# EAGLE design BusPirate-v4c (EAGLE 5.07)
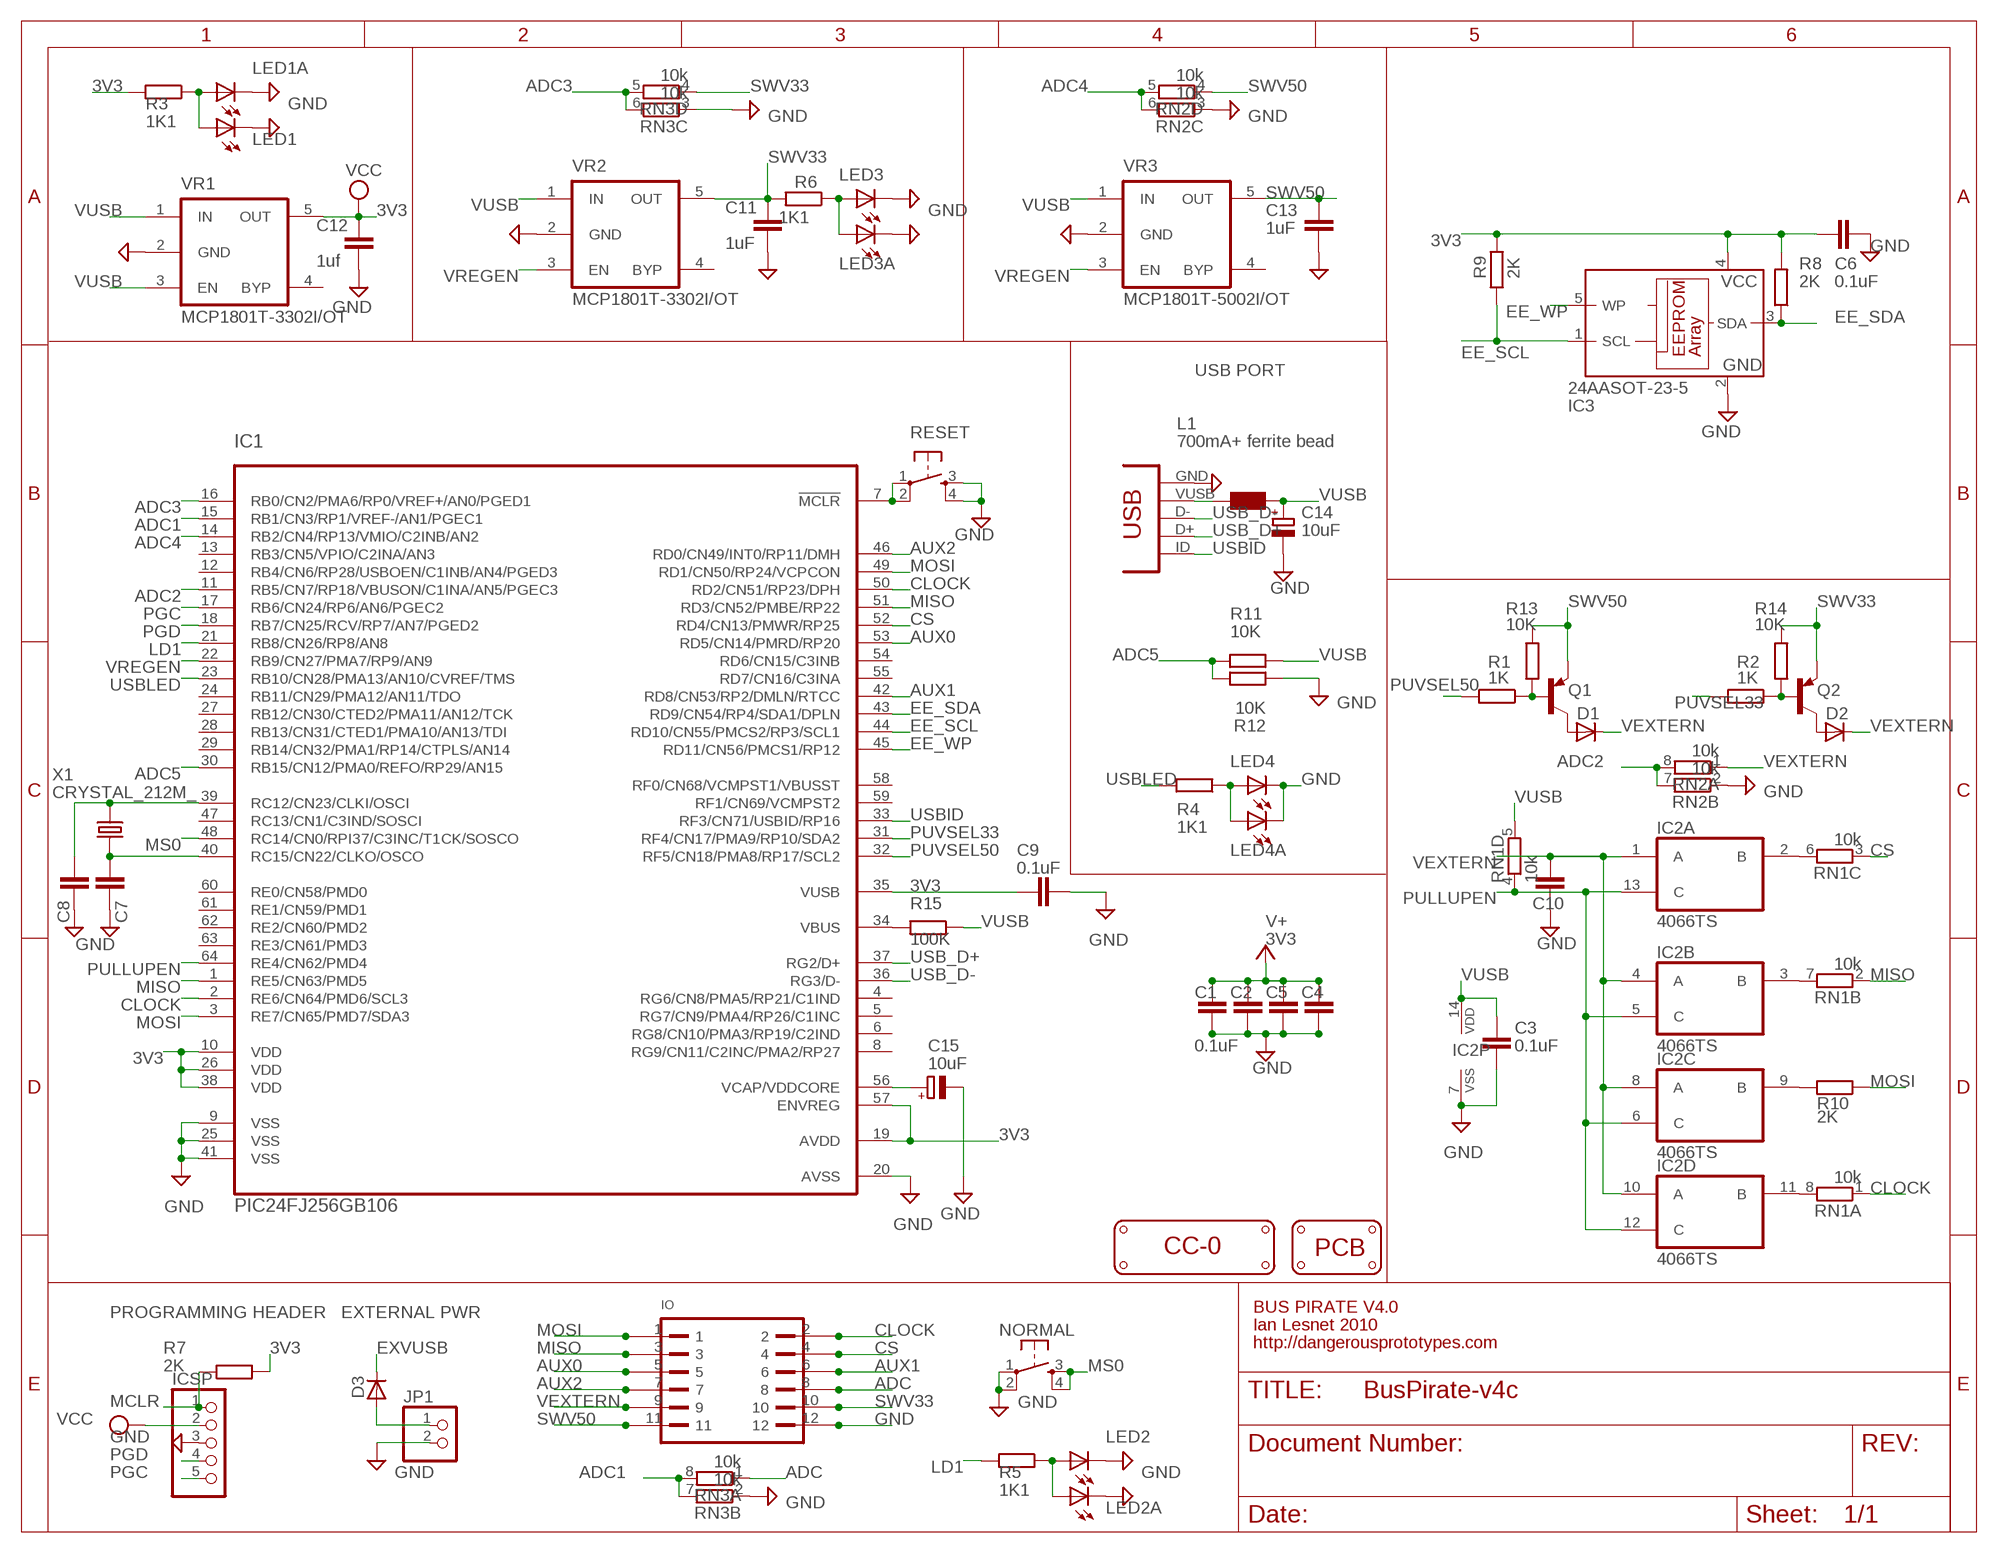
[diagram p0: schematic, sheet 1]

## Parts
C1  0.1uF  C-EUC0603  [C0603]
C2  0.1uF  C-EUC0603  [C0603]
C3  0.1uF  C-EUC0603  [C0603]
C4  0.1uF  C-EUC0603  [C0603]
C5  0.1uF  C-EUC0603  [C0603]
C6  0.1uF  C-EUC0603  [C0603]
C7  0.1uF  C-EUC0603  [C0603]
C8  0.1uF  C-EUC0603  [C0603]
C9  0.1uF  C-EUC0603  [C0603]
C10  0.1uF  C-EUC0603  [C0603]
C11  1uF  C-EUC0603  [C0603]
C12  1uf  C-EUC0603  [C0603]
C13  1uF  C-EUC0603  [C0603]
C14  10uF  CPOL-EUSMCA  [SMC_A]
C15  10uF  CPOL-EUSMCA  [SMC_A]
D1  MBR0520LT  [SOD123]
D2  MBR0520LT  [SOD123]
D3  MBR0520LT  [SOD123]
IC1  PIC24FJ256GB106  [TQFP64-10X10]
IC2  4066TS  [40XX_TSSOP14]
IC3  24AASOT-23-5  24AA  [SOT-23-5]
ICSP  PINHD-1X5  [1X05]
IO  PINSHRD-PTH-2X06  [PINSHRD_PTH_2X06]
JP1  PINHD-1X02_2.54-S  [1X02-S]
L1  700mA+ ferrite bead  WE-KIL_0805  [WE-KI_0805_B]
LED1  LEDCHIP-LED0805  [CHIP-LED0805]
LED1A  LEDCHIP-LED0805  [CHIP-LED0805]
LED2  LEDCHIP-LED0805  [CHIP-LED0805]
LED2A  LEDCHIP-LED0805  [CHIP-LED0805]
LED3  LEDCHIP-LED0805  [CHIP-LED0805]
LED3A  LEDCHIP-LED0805  [CHIP-LED0805]
LED4  LEDCHIP-LED0805  [CHIP-LED0805]
LED4A  LEDCHIP-LED0805  [CHIP-LED0805]
LOGO1  LOGO_CC-0  [LOGO_CC-0]
NORMAL  SMD_TACT_SMALL  [TACT_SWITCH_SMALL]
PCB1  PCB_DP_RECTANGLE-37X60  [DP6037_V1]
Q1  MMBTA56-SOT23  [SOT23]
Q2  MMBTA56-SOT23  [SOT23]
R1  1K  RESISTOR-0603  [R603]
R2  1K  R-EU_R0603  [R0603]
R3  1K1  RESISTOR-0603  [R603]
R4  1K1  RESISTOR-0603  [R603]
R5  1K1  RESISTOR-0603  [R603]
R6  1K1  RESISTOR-0603  [R603]
R7  2K  R-EU_R0603  [R0603]
R8  2K  R-EU_R0603  [R0603]
R9  2K  R-EU_R0603  [R0603]
R10  2K  R-EU_R0603  [R0603]
R11  10K  R-EU_R0603  [R0603]
R12  10K  R-EU_R0603  [R0603]
R13  10K  RESISTOR-0603  [R603]
R14  10K  R-EU_R0603  [R0603]
R15  100K  R-EU_R0603  [R0603]
RESET  SMD_TACT_SMALL  [TACT_SWITCH_SMALL]
RN1  10k  RNETWORK  [RN8P-4R-CRA06S]
RN2  10k  RNETWORK  [RN8P-4R-CRA06S]
RN3  10k  RNETWORK  [RN8P-4R-CRA06S]
USB  USB mini-b  CON-USB-MINI-BUSB1  [CONN_USB_MINI-B]
VR1  MCP1801T-3302I/OT  MIC5205  [SOT-23-5]
VR2  MCP1801T-3302I/OT  MIC5205  [SOT-23-5]
VR3  MCP1801T-5002I/OT  MIC5205  [SOT-23-5]
X1  CRYSTAL_212M_  [4X6]

## Nets
3V3: C1.1 C2.1 C4.1 C5.1 C6.1 C9.1 C12.1 IC1.10(VDD) IC1.19(AVDD) IC1.26(VDD) IC1.35(VUSB) IC1.38(VDD) IC1.57(ENVREG) IC3.4(VCC) ICSP.2 R3.2 R7.2 R8.2 R9.2 VR1.5(OUT) ; supply symbol labelled VCC, V+
ADC: IO.8 RN3.1
ADC1: IC1.15(RB1/CN3/RP1/VREF-/AN1/PGEC1) RN3.7 RN3.8
ADC2: IC1.11(RB5/CN7/RP18/VBUSON/C1INA/AN5/PGEC3) RN2.7 RN2.8
ADC3: IC1.16(RB0/CN2/PMA6/RP0/VREF+/AN0/PGED1) RN3.5 RN3.6
ADC4: IC1.14(RB2/CN4/RP13/VMIO/C2INB/AN2) RN2.5 RN2.6
ADC5: IC1.30(RB15/CN12/PMA0/REFO/RP29/AN15) R11.2 R12.2
AUX0: IC1.53(RD5/CN14/PMRD/RP20) IO.5
AUX1: IC1.42(RD8/CN53/RP2/DMLN/RTCC) IO.6
AUX2: IC1.46(RD0/CN49/INT0/RP11/DMH) IO.7
CLOCK: IC1.2(RE6/CN64/PMD6/SCL3) IC1.50(RD2/CN51/RP23/DPH) IO.2 RN1.1
CS: IC1.52(RD4/CN13/PMWR/RP25) IO.4 RN1.3
EE_SCL: IC1.44(RD10/CN55/PMCS2/RP3/SCL1) IC3.1(SCL) R9.1
EE_SDA: IC1.43(RD9/CN54/RP4/SDA1/DPLN) IC3.3(SDA) R8.1
EE_WP: IC1.45(RD11/CN56/PMCS1/RP12) IC3.5(WP)
EXVUSB: D3.C L1.2 USB.VUSB
GND: C1.2 C2.2 C3.2 C4.2 C5.2 C6.2 C7.2 C8.2 C9.2 C10.2 C11.2 C12.2 C13.2 C14.- C15.- IC1.9(VSS) IC1.20(AVSS) IC1.25(VSS) IC1.41(VSS) IC2.7(P:VSS) IC3.2(GND) ICSP.3 IO.12 JP1.2 LED1.C LED1A.C LED2.C LED2A.C LED3.C LED3A.C LED4.C LED4A.C NORMAL.1 NORMAL.2 R12.1 RESET.3 RESET.4 RN2.2 RN2.3 RN3.2 RN3.3 USB.GND VR1.2(GND) VR2.2(GND) VR3.2(GND)
LD1: IC1.21(RB8/CN26/RP8/AN8) R5.2
MCLR: IC1.7(!MCLR) ICSP.1 R7.1 RESET.1 RESET.2
MISO: IC1.1(RE5/CN63/PMD5) IC1.51(RD3/CN52/PMBE/RP22) IO.3 RN1.2
MOSI: IC1.3(RE7/CN65/PMD7/SDA3) IC1.49(RD1/CN50/RP24/VCPCON) IO.1 R10.1
MS0: IC1.48(RC14/CN0/RPI37/C3INC/T1CK/SOSCO) NORMAL.3 NORMAL.4
N$1: IC2.9(C:B) R10.2
N$2: IC2.11(D:B) RN1.8
N$3: D1.A Q1.3(C)
N$4: IC2.2(A:B) RN1.6
N$5: IC2.3(B:B) RN1.7
N$6: LED2.A LED2A.A R5.1
N$7: LED1.A LED1A.A R3.1
N$8: Q2.1(B) R2.1 R14.2
N$9: C7.1 IC1.40(RC15/CN22/CLKO/OSCO) X1.2(X2)
N$10: C15.+ IC1.56(VCAP/VDDCORE)
N$11: IC1.34(VBUS) R15.2
N$12: C8.1 IC1.39(RC12/CN23/CLKI/OSCI) X1.1(X1)
N$13: LED4.A LED4A.A R4.1
N$14: D2.A Q2.3(C)
N$15: D3.A JP1.1
N$17: Q1.1(B) R1.1 R13.2
N$18: LED3.A LED3A.A R6.1
PGC: IC1.17(RB6/CN24/RP6/AN6/PGEC2) ICSP.5
PGD: IC1.18(RB7/CN25/RCV/RP7/AN7/PGED2) ICSP.4
PULLUPEN: IC1.64(RE4/CN62/PMD4) IC2.5(B:C) IC2.6(C:C) IC2.12(D:C) IC2.13(A:C) RN1.4
PUVSEL33: IC1.31(RF4/CN17/PMA9/RP10/SDA2) R2.2
PUVSEL50: IC1.32(RF5/CN18/PMA8/RP17/SCL2) R1.2
SWV33: C11.1 IO.10 Q2.2(E) R6.2 R14.1 RN3.4 VR2.5(OUT)
SWV50: C13.1 IO.11 Q1.2(E) R13.1 RN2.4 VR3.5(OUT)
USB_D+: IC1.37(RG2/D+) USB.D+
USB_D-: IC1.36(RG3/D-) USB.D-
USBID: IC1.33(RF3/CN71/USBID/RP16) USB.ID(USBID)
USBLED: IC1.23(RB10/CN28/PMA13/AN10/CVREF/TMS) R4.2
VEXTERN: C10.1 D1.C D2.C IC2.1(A:A) IC2.4(B:A) IC2.8(C:A) IC2.10(D:A) IO.9 RN2.1
VREGEN: IC1.22(RB9/CN27/PMA7/RP9/AN9) VR2.3(EN) VR3.3(EN)
VUSB: C3.1 C14.+ IC2.14(P:VDD) L1.1 R11.1 R15.1 RN1.5 VR1.1(IN) VR1.3(EN) VR2.1(IN) VR3.1(IN)
Unconnected: IC1.4(RG6/CN8/PMA5/RP21/C1IND) IC1.5(RG7/CN9/PMA4/RP26/C1INC) IC1.6(RG8/CN10/PMA3/RP19/C2IND) IC1.8(RG9/CN11/C2INC/PMA2/RP27) IC1.12(RB4/CN6/RP28/USBOEN/C1INB/AN4/PGED3) IC1.13(RB3/CN5/VPIO/C2INA/AN3) IC1.24(RB11/CN29/PMA12/AN11/TDO) IC1.27(RB12/CN30/CTED2/PMA11/AN12/TCK) IC1.28(RB13/CN31/CTED1/PMA10/AN13/TDI) IC1.29(RB14/CN32/PMA1/RP14/CTPLS/AN14) IC1.47(RC13/CN1/C3IND/SOSCI) IC1.54(RD6/CN15/C3INB) IC1.55(RD7/CN16/C3INA) IC1.58(RF0/CN68/VCMPST1/VBUSST) IC1.59(RF1/CN69/VCMPST2) IC1.60(RE0/CN58/PMD0) IC1.61(RE1/CN59/PMD1) IC1.62(RE2/CN60/PMD2) IC1.63(RE3/CN61/PMD3) USB.BODY@1(BODY) USB.BODY@2(BODY) USB.BODY@3(BODY) USB.BODY@4(BODY) VR1.4(BYP) VR2.4(BYP) VR3.4(BYP)

## Notes on the sheet
- USB PORT
- BUS PIRATE V4.0
- PROGRAMMING HEADER | EXTERNAL PWR
- Ian Lesnet 2010
- http://dangerousprototypes.com

## Library data of the parts
C1-C13 = rcl:C-EU: CAPACITOR, European symbol
C14 C15 = rcl:CPOL-EU: POLARIZED CAPACITOR, European symbol
D1-D3 = diode:MBR0520LT: SCHOTTKY BARRIER RECTIFIER Source: http://onsemi.com .. MBR0520LT1-D.pdf
IC1 = dp_devices:PIC24FJ256GB106: 16-Bit Flash Microcontroller with USB On-The-Go(OTG)
IC2 = 40xx:4066: Quad bilateral ANALOG SWITCH
IC3 = dp_devices:24AA*; 24AA: 24AA
ICSP = pinhead:PINHD-1X5: PIN HEADER
IO = dp_devices:PINSHRD-PTH-2X06: Shrouded pin header, 2.54mm pitch
JP1 = pinhead-2:PINHD-1X02: PIN HEADER
L1 = wuerth-elektronik:WE-KIL: SMD Wire Wound Ceramic Inductor WE-KIL - Low profile - High Q values -- Bluetooth -- Wireless LAN -- RF oscillation circuit -- IF impedance matching
LED1 LED1A LED2 LED2A LED3 LED3A LED4 LED4A = led:LED: LED OSRAM: - CHIPLED LG R971, LG N971, LY N971, LG Q971, LY Q971, LO R971, LY R971 LH N974, LH R974 LS Q976, LO Q976, LY Q976 LO Q996 - Hyper CHIPLED LW Q18S LB Q993, LB Q99A, LB R99A - SideLED LS A670, LO A670, LY A670, LG A670, LP A670 LB A673, LV A673, LT A673, LW A673 LH A674 LY A675 LS A676, LA A676, LO A676, LY A676, LW A676 LS A679, LY A679, LG A679 - Hyper Micro SIDELED® LS Y876, LA Y876, LO Y876, LY Y876 LT Y87S - SmartLED LW L88C, LW L88S LB L89C, LB L89S, LG L890 LS L89K, LO L89K, LY L89K LS L896, LA L896, LO L896, LY L896 - TOPLED LS T670, LO T670, LY T670, LG T670, LP T670 LSG T670, LSP T670, LSY T670, LOP T670, LYG T670 LG T671, LOG T671, LSG T671 LB T673, LV T673, LT T673, LW T673 LH T674 LS T676, LA T676, LO T676, LY T676, LB T676, LH T676, LSB T676, LW T676 LB T67C, LV T67C, LT T67C, LS T67K, LO T67K, LY T67K, LW E67C LS E67B, LA E67B, LO E67B, LY E67B, LB E67C, LV E67C, LT E67C LW T67C LS T679, LY T679, LG T679 LS T770, LO T770, LY T770, LG T770, LP T770 LB T773, LV T773, LT T773, LW T773 LH T774 LS E675, LA E675, LY E675, LS T675 LS T776, LA T776, LO T776, LY T776, LB T776 LHGB T686 LT T68C, LB T68C - Hyper Mini TOPLED® LB M676 - Mini TOPLED Santana® LG M470 LS M47K, LO M47K, LY M47K Source: http://www.osram.convergy.de LUXEON: - LUMILED® LXK2-PW12-R00, LXK2-PW12-S00, LXK2-PW14-U00, LXK2-PW14-V00 LXK2-PM12-R00, LXK2-PM12-S00, LXK2-PM14-U00 LXK2-PE12-Q00, LXK2-PE12-R00, LXK2-PE12-S00, LXK2-PE14-T00, LXK2-PE14-U00 LXK2-PB12-K00, LXK2-PB12-L00, LXK2-PB12-M00, LXK2-PB14-N00, LXK2-PB14-P00, LXK2-PB14-Q00 LXK2-PR12-L00, LXK2-PR12-M00, LXK2-PR14-Q00, LXK2-PR14-R00 LXK2-PD12-Q00, LXK2-PD12-R00, LXK2-PD12-S00 LXK2-PH12-R00, LXK2-PH12-S00 LXK2-PL12-P00, LXK2-PL12-Q00, LXK2-PL12-R00 Source: www.luxeon.com KINGBRIGHT: KA-3528ASYC Source: www.kingbright.com
LOGO1 = dp_devices:LOGO_CC-0
NORMAL RESET = dp_devices:SMD_TACT_SMALL
PCB1 = dp_devices:PCB_DP_RECTANGLE: Dangerous Prototypes Standard Rectangular PCB sizes
Q1 Q2 = transistor-pnp:*-?: PNP Transistor
R1 R3-R6 R13 = dp_devices:RESISTOR
R2 R7-R10 R14 R15 = rcl:R-EU_: RESISTOR, European symbol
R11 R12 = resistor:R-EU_: RESISTOR, European symbol
RN1-RN3 = dp_devices:RNETWORK: 4 Resistor Array 0603
USB = dp_devices:CON-USB-MINI-B: USB connector
VR1-VR3 = dp_devices:MIC5205: 150ma Low-Noise LDO Regulator
X1 = dp_devices:CRYSTAL_2

## Board
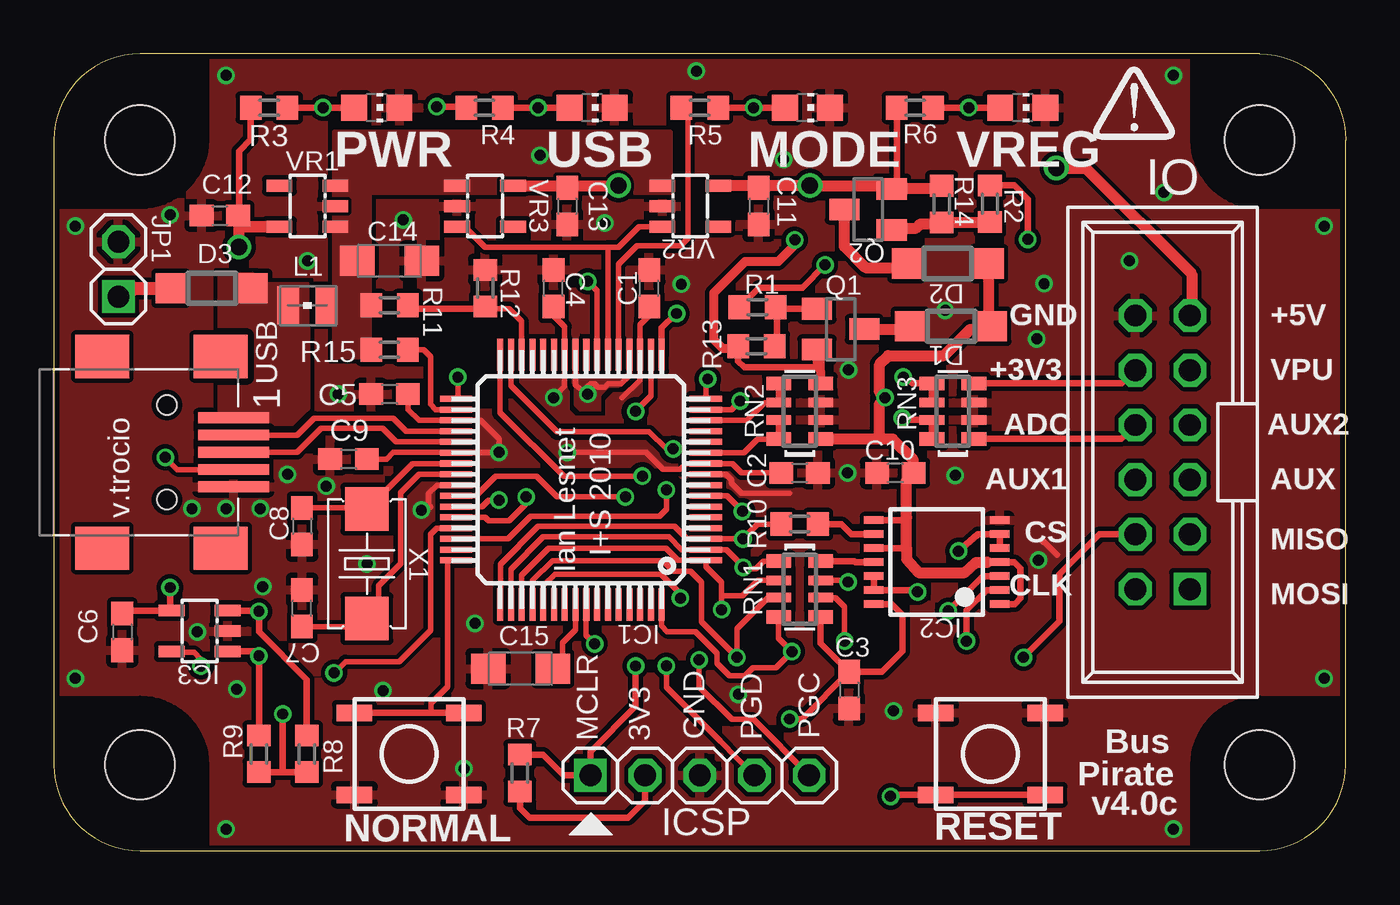
[diagram p1: board, top side]
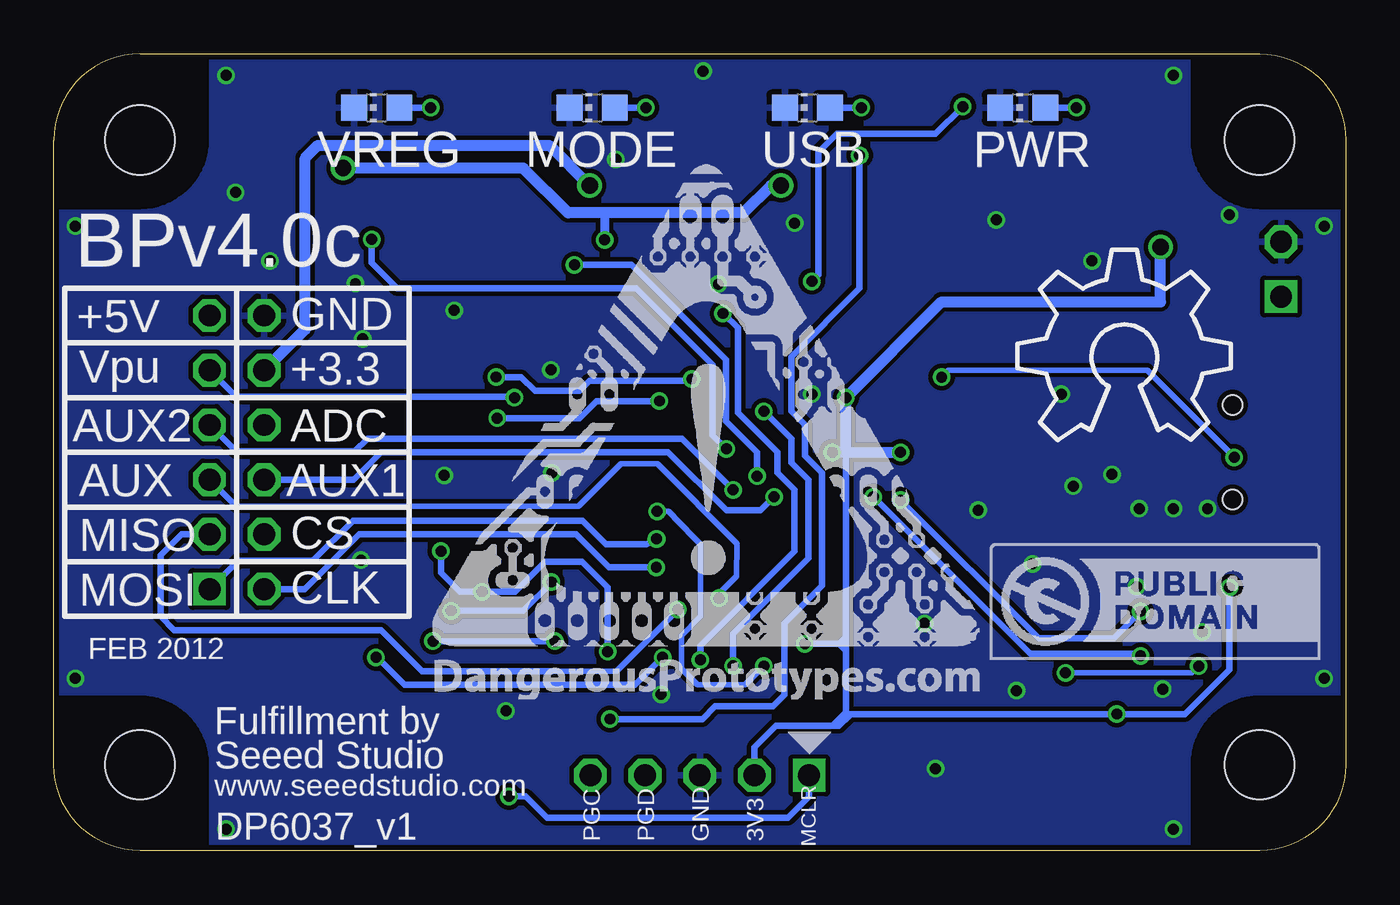
[diagram p2: board, bottom side, seen from below]

Size 60 x 37 mm. Coordinates in mm from the lower left corner, seen from the top.
Copper layers (1*16): Top 0.035mm / dielectric 1.5mm / Bottom 0.035mm
Design rules "Fusion_eagle_rule_v1.1": minimum track width 6mil, minimum drill 12mil, track to track 6mil, track to pad 6mil, pad to pad 6mil, via to via 6mil, smd to smd 0mil, copper to edge 10mil, drill to drill 10mil, minimum pad ring 10mil, minimum via ring 6mil, stop-mask expansion 2mil, vias tented up to drill 100mil, thermal gap 10mil

### Footprints (pad centres in the part's own frame; a part is rotated, then mirrored left to right if it is on the bottom)
C0603 = smd 1.1 x 1: 1 -0.85,0; 2 0.85,0
SMC_A = smd 1.6 x 1.4: + -1.5,0; - 1.5,0
SOD123 = smd 1.4 x 1.4: A 1.9,0; C -1.9,0
TQFP64-10X10 = smd 1.5 x 0.28: 1 -5.8,3.75; 2 -5.8,3.25; 3 -5.8,2.75; 4 -5.8,2.25; 5 -5.8,1.75; 6 -5.8,1.25; 7 -5.8,0.75; 8 -5.8,0.25; 9 -5.8,-0.25; 10 -5.8,-0.75; 11 -5.8,-1.25; 12 -5.8,-1.75; 13 -5.8,-2.25; 14 -5.8,-2.75; 15 -5.8,-3.25; 16 -5.8,-3.75; 33 5.8,-3.75; 34 5.8,-3.25; 35 5.8,-2.75; 36 5.8,-2.25; 37 5.8,-1.75; 38 5.8,-1.25; 39 5.8,-0.75; 40 5.8,-0.25; 41 5.8,0.25; 42 5.8,0.75; 43 5.8,1.25; 44 5.8,1.75; 45 5.8,2.25; 46 5.8,2.75; 47 5.8,3.25; 48 5.8,3.75 | smd 0.28 x 1.5: 17 -3.75,-5.8; 18 -3.25,-5.8; 19 -2.75,-5.8; 20 -2.25,-5.8; 21 -1.75,-5.8; 22 -1.25,-5.8; 23 -0.75,-5.8; 24 -0.25,-5.8; 25 0.25,-5.8; 26 0.75,-5.8; 27 1.25,-5.8; 28 1.75,-5.8; 29 2.25,-5.8; 30 2.75,-5.8; 31 3.25,-5.8; 32 3.75,-5.8; 49 3.75,5.8; 50 3.25,5.8; 51 2.75,5.8; 52 2.25,5.8; 53 1.75,5.8; 54 1.25,5.8; 55 0.75,5.8; 56 0.25,5.8; 57 -0.25,5.8; 58 -0.75,5.8; 59 -1.25,5.8; 60 -1.75,5.8; 61 -2.25,5.8; 62 -2.75,5.8; 63 -3.25,5.8; 64 -3.75,5.8
40XX_TSSOP14 = smd 0.35 x 0.9: 1 -1.95,-2.925; 2 -1.3,-2.925; 3 -0.65,-2.925; 4 0,-2.925; 5 0.65,-2.925; 6 1.3,-2.925; 7 1.95,-2.925; 8 1.95,2.925; 9 1.3,2.925; 10 0.65,2.925; 11 0,2.925; 12 -0.65,2.925; 13 -1.3,2.925; 14 -1.95,2.925
SOT-23-5 = smd 0.55 x 1.2: 1 -0.95,-1.3; 2 0,-1.3; 3 0.95,-1.3; 4 0.95,1.3; 5 -0.95,1.3
1X05 = drill 1.016 square: 1 -5.08,0 | drill 1.016 octagon: 2 -2.54,0; 3 0,0; 4 2.54,0; 5 5.08,0
PINSHRD_PTH_2X06 = drill 1.016 square: 1 -6.35,-1.27 | drill 1.016 octagon: 2 -6.35,1.27; 3 -3.81,-1.27; 4 -3.81,1.27; 5 -1.27,-1.27; 6 -1.27,1.27; 7 1.27,-1.27; 8 1.27,1.27; 9 3.81,-1.27; 10 3.81,1.27; 11 6.35,-1.27; 12 6.35,1.27
1X02-S = drill 1.016 square: 1 -1.27,0 | drill 1.016 octagon: 2 1.27,0
WE-KI_0805_B = smd 1.02 x 1.78: 1 -0.89,0; 2 0.89,0
CHIP-LED0805 = smd 1.2 x 1.2: A 0,-1.05; C 0,1.05
TACT_SWITCH_SMALL@1 = smd 1.651 x 0.762: 1 -2.54,1.905; 2 2.54,1.905; 3 -2.54,-1.905; 4 2.54,-1.905
DP6037_V1 = hole 3.2: 4,4; 56,4; 56,33; 4,33
SOT23 = smd 1 x 1.4: 1 -0.95,-1.1; 2 0.95,-1.1; 3 0,1.1
R603 = smd 1 x 1.1: 1 -0.85,0; 2 0.85,0
R0603 = smd 1 x 1.1: 1 -0.85,0; 2 0.85,0
RN8P-4R-CRA06S = smd 0.63 x 1.15: 1 -1.295,-0.975; 4 1.295,-0.975; 5 1.295,0.975; 8 -1.295,0.975 | smd 0.44 x 1.15: 2 -0.4,-0.975; 3 0.4,-0.975; 6 0.4,0.975; 7 -0.4,0.975
CONN_USB_MINI-B = smd 2 x 2.5: BODY@1 -4.45,2.5; BODY@2 4.45,2.5; BODY@3 4.45,-3; BODY@4 -4.45,-3 | smd 0.5 x 3.3: D+ 0,3.1; D- -0.8,3.1; GND 1.6,3.1; ID 0.8,3.1; VUSB -1.6,3.1 | hole 0.9: -2.2,0; 2.2,0
4X6@1 = smd 2.032 x 2.032: 1 -2.54,0; 2 2.54,0

### Placement (x,y rotation side)
C1  27.66,26.12 90 top
C2  34.64,17.55 0 top
C3  36.94,7.46 270 top
C4  23.21,26.12 90 top
C5  15.59,21.2 180 top
C6  3.17,10.16 270 top
C7  11.53,11.26 90 top
C8  11.53,15.07 270 top
C9  13.69,18.18 180 top
C10  39.09,17.55 180 top
C11  32.73,29.93 270 top
C12  7.72,29.49 180 top
C13  23.84,29.93 270 top
C14  15.59,27.39 0 top
C15  21.67,8.46 180 top
D1  41.67,24.35 180 top
D2  41.52,27.26 180 top
D3  7.33,26.12 180 top
IC1  24.48,17.23 180 top
IC2  41.01,13.4 90 top
IC3  6.77,10.2 90 top
ICSP  30,3.5 0 top
IO  51.5,18.5 90 top
JP1  3,27 90 top
L1  11.78,25.33 180 top
LED1  15,34.5 270 top
LED1A  15,34.5 90 bottom
LED2  35,34.5 270 top
LED2A  35,34.5 90 bottom
LED3  45,34.5 270 top
LED3A  45,34.5 90 bottom
LED4  25,34.5 270 top
LED4A  25,34.5 90 bottom
LOGO1  16.51,8.89 0 bottom
NORMAL  SMD_TACT_SMALL  [TACT_SWITCH_SMALL@1]  16.5,4.5 180 top
PCB1  0,0 0 top
Q1  36.55,24.21 270 top
Q2  37.81,29.78 90 top
R1  32.68,25.23 180 top
R2  43.48,30.04 90 top
R3  10,34.5 180 top
R4  20,34.5 180 top
R5  30,34.5 180 top
R6  40,34.5 180 top
R7  21.65,3.61 270 top
R8  11.75,4.5 270 top
R9  9.53,4.5 270 top
R10  34.64,15.17 0 top
R11  15.59,25.33 0 top
R12  20.04,26.12 270 top
R13  32.63,23.42 0 top
R14  41.24,30.03 270 top
R15  15.59,23.26 0 top
RESET  SMD_TACT_SMALL  [TACT_SWITCH_SMALL@1]  43.5,4.5 180 top
RN1  34.64,12.15 270 top
RN2  34.64,20.41 90 top
RN3  41.75,20.41 90 top
U$1  [DP-LOGO]  48.26,33.02 0 top
U$2  [OSHW_8X350_NOTEXT]  15.24,19.05 0 bottom
U$3  [DP_LOGO_ART_1X1]  42.39,7.04 0 bottom
USB  5.25,18.5 270 top
VR1  MIC5205-3.3BM5  [SOT-23-5]  11.78,29.93 90 top
VR2  MIC5205-3.3BM5  [SOT-23-5]  29.56,29.93 270 top
VR3  MIC5205-5.0BM5  [SOT-23-5]  20.04,29.93 270 top
X1  CRYSTAL_212M_  [4X6@1]  14.54,13.32 270 top

### Tracks (layer width: path | path; a pad name or v marks a point on that pad's centre or on a via)
3V3  (via drill 0.51, 0.76)
  Top 0.254: 16.38,21.04 C5.1 16.46,21.18 16.46,20.48 16.97,19.98 IC1.35 19.82,19.98 20.67,19.14 v20.67,18.5 | C1.1 27.66,24.85 27.23,24.43 IC1.19 27.23,21.84 26.39,21.04 | C4.1 23.21,24.85 23.73,24.33 IC1.26 23.73,21.56 v23.21,21.04 | C2.1 31.94,17.55 31.53,17.98 IC1.10 29.36,17.98 29.08,17.71 28.29,17.71 27.5,18.5 v23.84,18.5 | C9.1 15.45,18.18 15.77,18.5 20.51,18.5 v20.67,18.5 | IC1.38 20.49,18.48 v20.67,18.5 | IC1.57 24.73,9.99 v25.11,9.61
  Top 0.305: 8.61,29.23 8.61,32.49 9.15,33.03 R3.2 | R7.2 21.65,1.98 22.1,1.52 26.67,1.52 27.46,2.31 ICSP.2 | C6.1 3.32,11.15 IC3.4 5.4,11.22 v5.4,12.22 | 10.64,3.65 v10.64,6.35 | 10.64,3.65 R8.2 | R9.2 10.64,3.65
  Top 0.508: v8.61,28.02 8.61,28.34 8.6,28.98 VR1.5 8.89,28.98 8.61,28.98 8.61,29.23 C12.1
  Bottom 0.305: 23.21,9.61 23.21,9.93 | 23.21,9.93 23.21,18.5 | 23.69,5.8 23.53,5.8 23.05,6.28 23.21,6.28 | 23.21,9.61 23.53,9.61 | 23.53,9.61 v25.11,9.61 | 23.21,6.43 23.21,9.29 | 23.21,9.29 23.21,9.61 | 23.21,6.43 23.21,6.28 | 23.69,5.8 23.21,6.28 | 23.84,5.8 23.69,5.8 | 23.3,6.35 23.21,6.43 | 23.53,9.61 23.21,9.93 | 23.21,9.29 23.53,9.61 | 23.84,5.8 26.46,5.8 27.46,4.8 ICSP.2 | v5.4,12.22 5.4,8.41 7.46,6.35 v10.64,6.35 23.3,6.35 | 23.3,6.35 23.84,5.8
  Bottom 0.508: v8.61,28.02 8.61,25.48 18.77,25.48 v23.21,21.04 | 23.21,18.5 v23.21,21.04 | 23.21,18.5 v20.67,18.5 | v23.21,21.04 | 23.21,18.5 v23.84,18.5 | 23.21,18.5 v23.21,21.04
  pour Top (isolate 0.254, no thermals): 20.67,24.21 23.21,24.21 23.84,23.58 23.84,20.41 24.16,20.09 25.75,20.09 25.75,20.88 26.54,21.68 28.93,21.68 28.93,17.86 18.77,17.86 18.77,20.41 20.67,20.41
ADC
  Top 0.305: RN3.1 43.26,19.14 49.58,19.14 IO.8
ADC1  (via drill 0.51)
  Top 0.254: IC1.15 31.47,20.48 v31.87,20.88
  Top 0.305: v39.41,20.09 39.6,20 RN3.7 RN3.8
  Bottom 0.305: v39.41,20.09 35.59,20.09 34.8,20.88 v31.87,20.88
ADC2
  Top 0.254: RN2.7 RN2.8 32.69,19.11 32.06,18.48 IC1.11
ADC3  (via drill 0.51)
  Top 0.254: IC1.16 30.28,21.81 v30.37,21.9
  Top 0.305: v39.46,22 39.88,21.71 RN3.5 RN3.6
  Bottom 0.305: v39.46,22 38.29,21.99 37.66,21.36 35.59,21.36 35.12,21.83 30.44,21.83 v30.37,21.9
ADC4
  Top 0.254: RN2.5 RN2.6 33.02,20.8 32.2,19.98 IC1.14
ADC5
  Top 0.254: IC1.30 21.73,24.58 21.15,25.17 20.14,25.17 R12.2
  Top 0.305: R11.2 16.44,25.27 16.54,25.17 19.93,25.17 R12.2
AUX0  (via drill 0.51)
  Top 0.254: IC1.53 22.73,12.3 23.27,12.84 28.21,12.84 29.1,11.94 v29.1,11.73
  Bottom 0.254: v29.1,11.73 29.1,11.94 28.29,12.75 28.27,14.26 31.97,17.96 33.66,17.96 35.62,16 51.53,16 IO.5
AUX1  (via drill 0.51)
  Top 0.254: IC1.42 19.6,16.48 20.51,17.39 22.42,17.39 23.37,16.44 v26.54,16.44
  Bottom 0.305: v26.54,16.44 27.18,15.8 28.77,15.8 31.46,18.5 44.8,18.5 46.07,17.23 IO.6
AUX2  (via drill 0.51)
  Top 0.254: IC1.46 21.09,14.48 22.15,15.54 28.13,15.54 28.45,15.85 v28.45,16.75
  Bottom 0.305: v28.45,16.75 30.83,19.14 45.44,19.14 46.03,18.54 51.53,18.54 IO.7
CLOCK  (via drill 0.51)
  Top 0.254: IC1.50 21.23,13.08 22.73,14.58 28.58,14.58 29.16,13.98 IC1.2 31.25,13.98 31.96,13.27 v32.02,13.16 32.03,13.11 32.62,13.11 32.96,13.45 RN1.1
  Bottom 0.305: v32.02,13.16 34.22,13.16 35.75,14.69 45.82,14.69 48.36,12.15 IO.2
CS  (via drill 0.51)
  Top 0.254: IC1.52 22.23,12.57 23.17,13.47 28.29,13.47 28.78,12.98 29.57,12.98 30.08,12.47 30.08,10.62 v31.73,8.97 31.73,10.31 33.17,11.75 RN1.3
  Top 0.305: IO.4 48.55,14.69 46.71,12.85 46.71,10.65 v45.03,8.97
  Bottom 0.305: v45.03,8.97 45,9 43.7,7.71 33,7.71 v31.73,8.97
EE_SCL  (via drill 0.51)
  Top 0.254: IC1.44 20.04,15.48 20.19,15.32 21.15,15.32 21.94,16.12 v21.94,16.44
  Top 0.305: R9.1 v9.53,9.05 9.32,9.25 IC3.1
  Bottom 0.305: v21.94,16.44 14.65,9.14 9.62,9.14 v9.53,9.05
EE_SDA  (via drill 0.51)
  Top 0.254: IC1.43 19.9,15.98 20.19,16.28 v20.67,16.28
  Top 0.305: IC3.3 9.49,11.15 v9.53,11.11 9.53,10.16 11.75,7.94 R8.1
  Bottom 0.305: v20.67,16.28 14.26,9.86 10.77,9.86 v9.53,11.11
EE_WP  (via drill 0.51)
  Top 0.254: IC1.45 17.79,14.98 17.5,14.69 17.5,10.24 16.03,8.78 13.54,8.78 v13.02,8.26 | v6.83,8.57 6.83,8.89 6.51,9.21 5.51,9.21 IC3.5
  Bottom 0.254: v13.02,8.26 7.14,8.26 v6.83,8.57
EXVUSB
  pour Top (isolate 0.305, no thermals): 7.72,21.68 8.99,21.68 8.99,24.21 7.72,24.21 7.72,26.75 9.24,26.75 9.72,26.28 11.78,26.28 11.78,20.56 11.05,19.83 7.72,19.83
GND  (via drill 0.51)
  Top 0.254: IC1.25 24.23,21.61 v24.8,21.2 24.8,21.56 24.92,21.68 25.11,21.68 25.27,21.52 25.59,21.52 25.75,21.68 26.34,21.68 26.73,22.06 IC1.20 | IC1.41 17.8,16.98 17.42,16.59 17.42,16.04 17.5,15.96 | IC1.9 31.21,17.48 31.46,17.23 31.46,17.07 31.94,16.59 34.16,16.59
  Top 0.305: 45.95,14.38 45.93,14.35 45.98,14.35 46.59,13.74
  other vias: 41.87,17.43 51.56,30.57 33.89,32.1 16.23,29.3 29.84,36.2 29.14,26.31 5.4,29.53 49.96,27.39 36.86,17.55 25.59,29.14 13.21,21.2 11.78,27.39 19.56,10.56 12.65,16.93 14.54,13.32 19.05,3.81 36.91,22.33 1,29 45.99,26.33 1,8 45.74,13.49 59,29 52,36 41.41,25.09 8,1 31.79,7.26 45.65,23.77 8,15.88 6.67,10.16 15.29,7.44 9.7,12.26 17.07,15.82 59,8 52,1 8,36 9.59,15.88 10.86,17.47 6.41,15.88 8.5,7.5 39,6.5
  pour Top (isolate 0.203, rank 2): 0,37.15 60.03,37.21 60.08,0.11 0.06,0.2
  pour Bottom (isolate 0.203, rank 2): 0,37.16 60.04,37.2 arc-3 60.06,0.15 0.03,0.23
LD1
  Top 0.254: IC1.21 26.23,27.23 27.09,28.1 29.11,28.1 29.46,28.45 29.46,34.19 R5.2
MCLR  (via drill 0.51)
  Top 0.254: IC1.7 31.26,16.48 v31.98,15.75
  Top 0.305: RESET.1 RESET.2 38.93,2.6 v38.86,2.52 | v27.02,8.58 27.02,6.7 24.92,4.6 ICSP.1 23.68,3.5 22.72,4.46 R7.1
  Bottom 0.254: v31.98,15.75 31.46,15.75 31.21,15.5 31.21,15.49 29.96,14.24 29.96,10.89 30.85,9.99 30.85,8.45 30.1,7.7 27.9,7.7 v27.02,8.58
  Bottom 0.305: v38.86,2.52 38.1,2.54 37.08,1.52 25.91,1.52 24.92,2.51 ICSP.1
MISO  (via drill 0.51)
  Top 0.254: IC1.51 21.73,12.79 22.98,14.04 28.43,14.04 29,13.48 IC1.1 30.28,13.2 31.02,12.46 31.02,11.84 | 31.02,11.84 v31.02,11.19 | RN1.2 32.7,12.55 31.98,11.84 31.02,11.84
  Bottom 0.254: 36.86,8.34 33.87,8.34 v31.02,11.19
  Bottom 0.305: 36.86,8.34 42.9,8.34 44.8,10.24 54.41,10.24 55.04,10.88 55.04,13.72 54.07,14.69 IO.3
MOSI  (via drill 0.51)
  Top 0.254: IC1.49 20.73,11.42 20.75,11.47 20.75,13.31 22.5,15.06 28.83,15.06 29.41,14.48 IC1.3 31.81,14.48 v32.01,14.48 32.69,15.17 R10.1
  Bottom 0.305: v32.01,14.48 32.48,14.24 34.35,14.24 35.43,15.32 46.1,15.32 47.97,13.46 51.44,13.46 IO.1
MS0
  Top 0.254: 18.7,13.46 18.77,13.46 | 18.7,13.46 IC1.48 | 18.7,13.46 18.29,13.46 18.29,7.62 17.53,6.86 17.53,6.41
  Top 0.305: NORMAL.4 17.53,6.41 NORMAL.3
N$1
  Top 0.305: R10.2 36.58,15.17 37.05,14.7 IC2.9
N$2
  Top 0.305: RN1.8 37.18,13.45 37.23,13.4 IC2.11
N$3
  Top 0.508: Q1.3 39.76,24.21 D1.A
N$4  (via drill 0.51)
  Top 0.254: RN1.6 36.31,11.75 36.72,11.34 v36.72,9.73
  Top 0.305: v42.39,9.74 42.39,11.17 43.33,12.11 IC2.2
  Bottom 0.305: v42.39,9.74 38.32,9.74 v36.72,9.73
N$5  (via drill 0.51)
  Top 0.254: RN1.7 36.82,12.55 v36.89,12.48
  Top 0.305: v41.54,11.13 43.16,12.75 IC2.3
  Bottom 0.305: v41.54,11.13 38.2,11.13 36.86,12.47 v36.89,12.48
N$6  (via drill 0.51)
  Top 0.305: R5.1 v32.5,34.5 LED2A.A
  Bottom 0.305: v32.5,34.5 LED2A.A
N$7  (via drill 0.51)
  Top 0.305: R3.1 v12.5,34.5 LED1A.A
  Bottom 0.305: v12.5,34.5 LED1A.A
N$8
  Top 0.508: R2.1 R14.2 40.97,29.11 40.26,29.11 40.06,28.91 39,28.91 Q2.1
N$9
  Top 0.254: X1.2 14.7,10.63 | C7.1 14.17,10.41 X1.2 | X1.2 15.09,11.34 15.09,12.3 16.11,13.32 16.11,16.62 16.97,17.48 IC1.40
N$10
  Top 0.254: IC1.56 24.23,10.26 23.62,9.65 23.62,8.9 C15.+
N$11
  Top 0.254: IC1.34 17.74,20.48 17.5,20.72 17.5,22.95 17.18,23.26 R15.2
N$12
  Top 0.254: C8.1 14.49,15.92 X1.1 16.66,17.98 IC1.39
N$13  (via drill 0.51)
  Top 0.305: R4.1 v22.5,34.5 LED4A.A
  Bottom 0.305: v22.5,34.5 LED4A.A
N$14
  Top 0.508: D2.A 39.26,27.16 39.17,27.07 37.7,27.07 36.72,28.06 Q2.3
N$15
  Top 0.61: JP1.1 3.33,25.73 3.72,26.12 D3.A
N$17
  Top 0.305: 33.6,25.16 Q1.1 | 33.6,25.16 R1.1 | 33.6,25.16 33.6,23.43 R13.2
N$18  (via drill 0.51)
  Top 0.305: R6.1 v42.5,34.5 LED3A.A
  Bottom 0.305: v42.5,34.5 LED3A.A
PGC  (via drill 0.51)
  Top 0.254: v29.97,8.86 29.97,7.62 31.5,6.1 32.48,6.1 ICSP.5
  Top 0.305: IC1.17 28.23,24.28 28.9,24.94 v28.92,24.94 v28.93,24.95
  Bottom 0.305: v29.97,8.86 29.97,9.53 25.59,13.91 25.59,16.75 26.39,17.55 26.39,18.5 28.23,20.34 28.23,24.28 28.9,24.94 v28.92,24.94 v28.93,24.95
PGD  (via drill 0.51)
  Top 0.254: v27.02,20.41 27.73,21.11 IC1.18 | ICSP.4 31.74,4.3 30.96,5.08 28.45,7.59 v28.45,8.58
  Bottom 0.305: v27.02,20.41 25.75,19.14 25.75,18.02 24.96,17.23 24.96,13.58 28.45,10.09 v28.45,8.58
PULLUPEN  (via drill 0.51)
  Top 0.254: 30.8,8.98 | 30.8,8.98 30.8,9.18 29.8,10.18 28.49,10.18 28.23,10.44 IC1.64 | RN1.4 33.66,9.86 v34.28,9.25 33.53,8.5 32.48,8.5 32.11,8.13 31.38,8.13 30.8,8.71 30.8,8.98
  Top 0.305: v40.12,12.02 40.04,12.1 IC2.13 IC2.12 | IC2.5 IC2.6 42.92,14.7 v42.02,13.91
  Bottom 0.305: v42.02,13.91 42.02,12.91 41.13,12.02 v40.12,12.02 38.58,12.02 37.18,13.42 35.48,13.42 34.28,12.23 v34.28,9.25
PUVSEL33  (via drill 0.51)
  Top 0.254: IC1.31 21.23,21.59 23.37,19.45 27.66,19.45 28.45,18.66 v28.77,18.66
  Top 0.305: R2.2 44.61,30.89 45.25,30.25 45.24,30.24 v45.24,28.39
  Bottom 0.305: v28.77,18.66 29.4,19.29 29.4,22.57 32.95,26.12 44.05,26.12 45.24,27.31 v45.24,28.39
PUVSEL50  (via drill 0.51)
  Top 0.254: IC1.32 20.73,20.34 23.69,17.39 v27.34,17.39
  Top 0.305: R1.2 32.74,26.15 34.76,26.15 v35.82,27.2
  Bottom 0.305: v27.34,17.39 27.34,18.5 28.78,19.95 28.78,22.8 33.18,27.2 v35.82,27.2
SWV33  (via drill 0.76)
  Top 0.305: 40.89,30.73 38.34,30.88 38.34,30.89 | RN3.4 49.6,21.7 IO.10 | R6.2 39.15,30.96 Q2.2
  Top 0.508: 33.37,30.88 VR2.5 | 33.37,30.88 C11.1 | 33.37,30.88 v35.12,30.88 v35.12,30.89 38.34,30.89 | Q2.2 40.89,30.73 R14.1
  Bottom 0.508: IO.10 48.32,24.2 48.32,32.17 47.74,32.75 36.98,32.75 v35.12,30.88
SWV50  (via drill 0.51, 0.76)
  Top 0.305: R13.1 31.79,22.72 32.07,22.44 35.4,22.44 35.62,22.23 | 35.41,22.67 35.41,23.23 Q1.2
  Top 0.406: R13.1 31.78,23.33 31.07,23.33 30.65,23.75 30.65,25.89 32.11,27.36 33.64,27.36 34.41,28.13 v34.41,28.37 | RN2.4 35.62,22.23 35.62,23.09 Q1.2
  Top 0.508: VR3.5 23.75,30.88 C13.1 23.95,30.88 v26.23,30.88 | IO.11 52.85,25.02 52.85,26.79 47.94,31.7 v46.56,31.7
  Bottom 0.406: v34.41,28.37 34.41,29.5 34.52,29.61
  Bottom 0.508: v26.23,30.88 26.7,30.88 27.97,29.61 34.52,29.61 36.11,29.61 38.2,31.7 v46.56,31.7
USB_D+
  Top 0.254: IC1.37 15.9,18.98 15.27,19.61 12.41,19.61 11.3,18.5 USB.D+
USB_D-
  Top 0.254: IC1.36 16.36,19.48 16.34,19.49 15.75,20.09 12.1,20.09 11.31,19.3 USB.D-
USBID  (via drill 0.51)
  Top 0.254: v18.77,21.99 18.77,21.07 IC1.33 | USB.ID 5.74,17.7 v5.18,18.27
  Bottom 0.254: v5.18,18.27 9.22,22.31 18.45,22.31 v18.77,21.99
USBLED  (via drill 0.51)
  Top 0.254: IC1.23 25.23,26 v24.8,26.44
  Top 0.305: v17.78,34.55 19.1,34.55 R4.2
  Bottom 0.254: v24.8,26.44 24.48,26.75
  Bottom 0.305: 24.48,26.75 24.48,32.42 23.62,33.28 19.05,33.28 v17.78,34.55
VEXTERN  (via drill 0.51)
  Top 0.305: IC2.8 39.49,15.35 39.6,15.47 | IC2.10 39.58,14.05 39.6,14.03 | 43.36,13.39 43.92,13.39 | 43.92,13.39 IC2.4 | 43.92,13.39 44.62,13.39 44.9,13.12 44.9,11.72 44.63,11.45 IC2.1
  Top 0.508: D2.C 43.45,24.32 D1.C 42.56,24.21 41.34,22.98 38.76,22.98 38.36,22.58 38.36,21.29 v38.61,21.04 38.61,21 38.34,20.73 38.34,19.11 | C10.1 40.17,17.79 | 38.34,19.11 RN2.1 | 38.34,19.11 38.95,19.11 39.92,18.14 39.92,17.56 C10.1 | C10.1 39.6,17.22 39.6,15.47 39.6,14.03 39.6,13.54 40.16,12.91 42.3,12.91 42.83,13.39 43.36,13.39 43.35,13.4
  Bottom 0.305: v38.61,21.04 38.8,21.04 38.56,21.04 38.51,21.08 51.53,21.08 IO.9
VREGEN
  Top 0.254: VR3.3 19.08,28.98 20.04,28.02 25.75,28.02 | 25.75,28.02 26.23,28.02 27.18,28.98 VR2.3 | IC1.22 25.73,28 25.75,28.02
VUSB  (via drill 0.51)
  Top 0.305: 35.62,10.74 RN1.5 35.62,9.63 C3.1 | IC2.14 38.92,11.45 39.41,10.96 39.41,9.26 38.46,8.31 C3.1 | v34.17,6.12 34.74,6.12 C3.1
  Bottom 0.305: v22.57,32.29 22.57,26.12 25.75,22.95 25.75,20.41 25.11,19.77 25.11,18.34 24.32,17.55 24.32,12.31 26.07,10.56 26.07,7.23 26.6,6.7 29.3,6.7 29.88,6.12 v34.17,6.12
  pour Top (no thermals): 13.05,33.37 28.61,33.37 28.61,30.57 14.64,30.57 14.64,22.95 13.05,22.95 13.05,29.45 13.69,29.45 13.69,30.41 13.05,30.41

### Text on the board
tPlace: v.trocio | I+S 2010 | Ian Lesnet | MCLR | 3V3 | GND | PGD | PGC
bPlace: FEB 2012
tNames: PWR | USB | MODE | VREG | GND | +5V | +3V3 | VPU | ADC | AUX2 | AUX1 | AUX | CS | MISO | CLK | MOSI | Bus | Pirate | v4.0c
bNames: PWR | USB | MODE | VREG | BPv4.0c | GND | +5V | +3.3 | Vpu | ADC | AUX2 | AUX1 | AUX | CS | MISO | CLK | MOSI | Fulfillment by | Seeed Studio | www.seeedstudio.com | MCLR | 3V3 | GND | PGD | PGC
tValues: vimark
Reference: EXT PWR | USB-OTG | V+ - GND | I/O header | GND | +5v | +3v | Vpu | USB | ADC | AUX2 | AUX1 | AUX | CS | MISO | CLK | MOSI | MCLR | +3.3V | GND | DATA | CLOCK | BUS PIRATE V4.0c | CC-0 | Ian Lesnet FEB 2012 | Programming Header | http://dangerousprototypes.com